# EAGLE design enclosure_controller_esp32 (EAGLE 9.6.2)
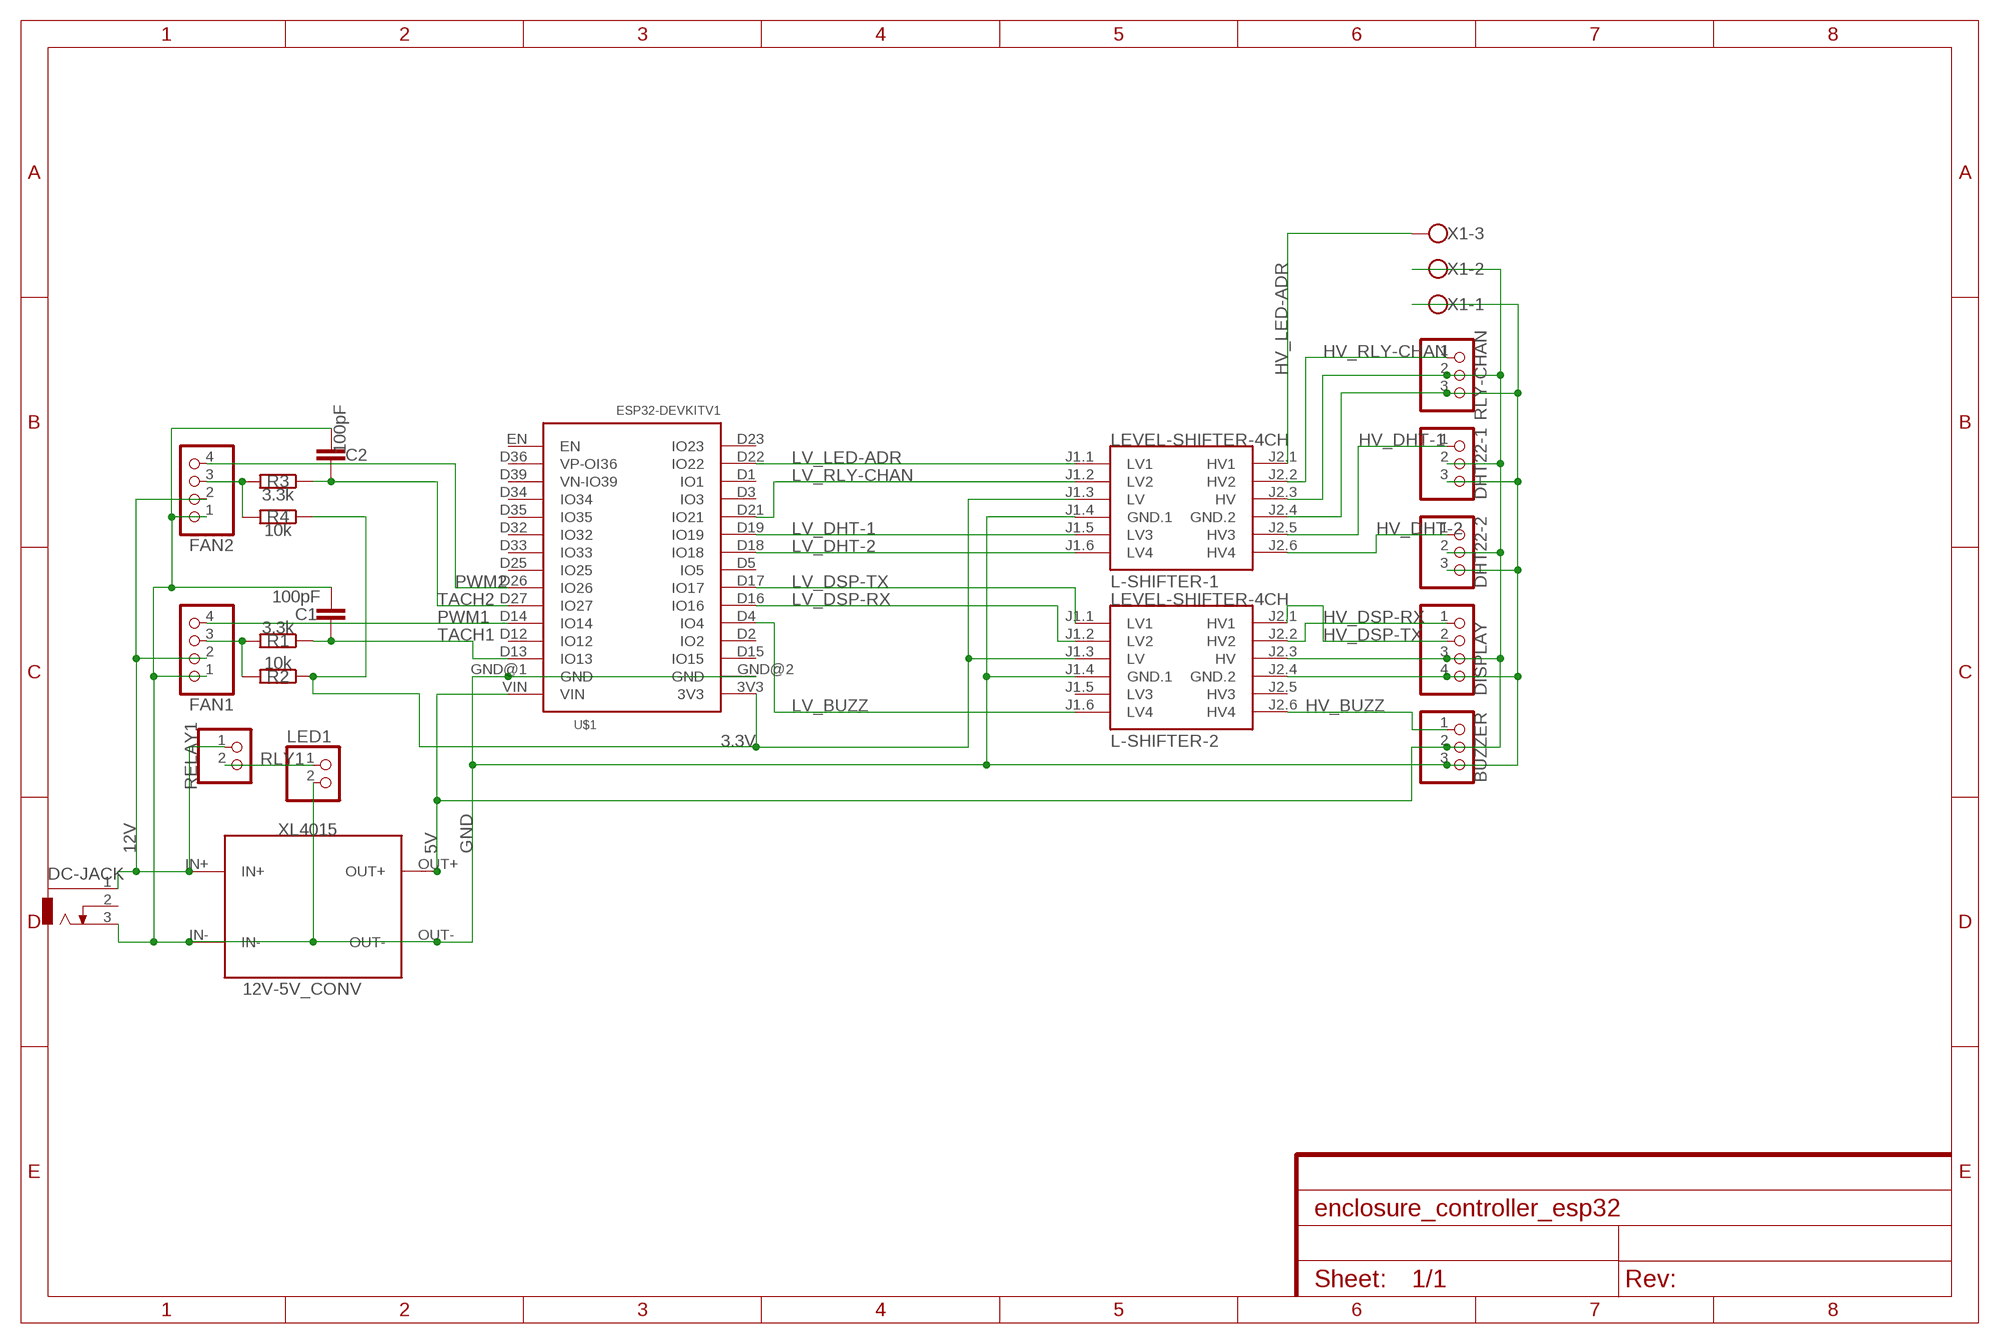
[diagram p0: schematic, sheet 1]

## Parts
12V-5V_CONV  XL4015  [XL4015]
BUZZER  PINHD-1X3  [1X03]
C1  100pF  C-EU050-025X075  [C050-025X075]
C2  100pF  C-EU050-025X075  [C050-025X075]
DC-JACK  DCJ0303  [DCJ0303]
DHT22-1  PINHD-1X3  [1X03]
DHT22-2  PINHD-1X3  [1X03]
DISPLAY  PINHD-1X4  [1X04]
FAN1  PINHD-1X4  [1X04]
FAN2  PINHD-1X4  [1X04]
L-SHIFTER-1  LEVEL-SHIFTER-4CH  [LEVEL-SHIFTER-4CH]
L-SHIFTER-2  LEVEL-SHIFTER-4CH  [LEVEL-SHIFTER-4CH]
LED1  PINHD-1X2  [1X02]
R1  3.3k  R-EU_0207/10  [0207/10]
R2  10k  R-EU_0207/10  [0207/10]
R3  3.3k  R-EU_0207/10  [0207/10]
R4  10k  R-EU_0207/10  [0207/10]
RELAY1  PINHD-1X2  [1X02]
RLY-CHAN  PINHD-1X3  [1X03]
U$1  ESP32DEVKITV1  [ESP32-DEVKITV1]
X1  LED2-ADR  W237-103  [W237-103]

## Nets
3.3V: L-SHIFTER-1.J1.3(LV) L-SHIFTER-2.J1.3(LV) R2.1 R4.1 U$1.3V3
5V: 12V-5V_CONV.OUT+ BUZZER.2 DHT22-1.2 DHT22-2.2 DISPLAY.3 L-SHIFTER-1.J2.3(HV) L-SHIFTER-2.J2.3(HV) RLY-CHAN.2 U$1.VIN X1.2
12V [Power]: 12V-5V_CONV.IN+ DC-JACK.1 FAN1.2 FAN2.2 RELAY1.1
GND: 12V-5V_CONV.IN- 12V-5V_CONV.OUT- BUZZER.3 C1.2 C2.1 DC-JACK.3 DHT22-1.3 DHT22-2.3 DISPLAY.4 FAN1.1 FAN2.1 L-SHIFTER-1.J1.4(GND.1) L-SHIFTER-1.J2.4(GND.2) L-SHIFTER-2.J1.4(GND.1) L-SHIFTER-2.J2.4(GND.2) LED1.2 RLY-CHAN.3 U$1.GND@1(GND) U$1.GND@2(GND) X1.1
HV_BUZZ: BUZZER.1 L-SHIFTER-2.J2.6(HV4)
HV_DHT-1: DHT22-1.1 L-SHIFTER-1.J2.5(HV3)
HV_DHT-2: DHT22-2.1 L-SHIFTER-1.J2.6(HV4)
HV_DSP-RX: DISPLAY.1 L-SHIFTER-2.J2.2(HV2)
HV_DSP-TX: DISPLAY.2 L-SHIFTER-2.J2.1(HV1)
HV_LED-ADR: L-SHIFTER-1.J2.1(HV1) X1.3
HV_RLY-CHAN: L-SHIFTER-1.J2.2(HV2) RLY-CHAN.1
LV_BUZZ [signals]: L-SHIFTER-2.J1.6(LV4) U$1.D4(IO4)
LV_DHT-1 [signals]: L-SHIFTER-1.J1.5(LV3) U$1.D19(IO19)
LV_DHT-2 [signals]: L-SHIFTER-1.J1.6(LV4) U$1.D18(IO18)
LV_DSP-RX: L-SHIFTER-2.J1.2(LV2) U$1.D16(IO16)
LV_DSP-TX: L-SHIFTER-2.J1.1(LV1) U$1.D17(IO17)
LV_LED-ADR: L-SHIFTER-1.J1.1(LV1) U$1.D22(IO22)
LV_RLY-CHAN: L-SHIFTER-1.J1.2(LV2) U$1.D21(IO21)
PWM1 [signals]: FAN1.4 U$1.D14(IO14)
PWM2 [signals]: FAN2.4 U$1.D26(IO26)
RLY1: LED1.1 RELAY1.2
TACH1 [signals]: C1.1 FAN1.3 R1.1 R1.2 R2.2 U$1.D13(IO13)
TACH2 [signals]: C2.2 FAN2.3 R3.1 R3.2 R4.2 U$1.D27(IO27)
Unconnected: DC-JACK.2 L-SHIFTER-2.J1.5(LV3) L-SHIFTER-2.J2.5(HV3) U$1.D1(IO1) U$1.D2(IO2) U$1.D3(IO3) U$1.D5(IO5) U$1.D12(IO12) U$1.D15(IO15) U$1.D23(IO23) U$1.D25(IO25) U$1.D32(IO32) U$1.D33(IO33) U$1.D34(IO34) U$1.D35(IO35) U$1.D36(VP-OI36) U$1.D39(VN-IO39) U$1.EN

## Library data of the parts
12V-5V_CONV = XL4015:XL4015
BUZZER DHT22-1 DHT22-2 RLY-CHAN = pinhead:PINHD-1X3: PIN HEADER
C1 C2 = rcl:C-EU: CAPACITOR, European symbol; SPICEPREFIX: C
DC-JACK = con-jack:DCJ0303: DC POWER JACK Source: DCJ0303.pdf; OC_FARNELL: unknown; OC_NEWARK: unknown
DISPLAY FAN1 FAN2 = pinhead:PINHD-1X4: PIN HEADER
L-SHIFTER-1 L-SHIFTER-2 = diy-modules:LEVEL-SHIFTER-4CH: 4-Channel Bi-Directional Logic Level Converter based on BSS128 transistors Click here to find device on ebay.com <http://www.ebay.com/sch/i2c+logic+converter+module>
LED1 RELAY1 = pinhead:PINHD-1X2: PIN HEADER
R1-R4 = rcl:R-EU_: RESISTOR, European symbol; SPICEPREFIX: R
U$1 = ESP32-DEVKITV1:ESP32DEVKITV1
X1 = con-wago-500:W237-103: WAGO SCREW CLAMP; MPN: 237-103; OC_FARNELL: unknown; OC_NEWARK: 18M7116

## Net classes
0 default: width 1 mm, drill 0.025 mm, clearance 0.4 mm
1 Power: width 1.5 mm, drill 0.025 mm, clearance 0.4 mm
2 signals: width 1 mm, drill 1 mm, clearance 0.4 mm

## Board
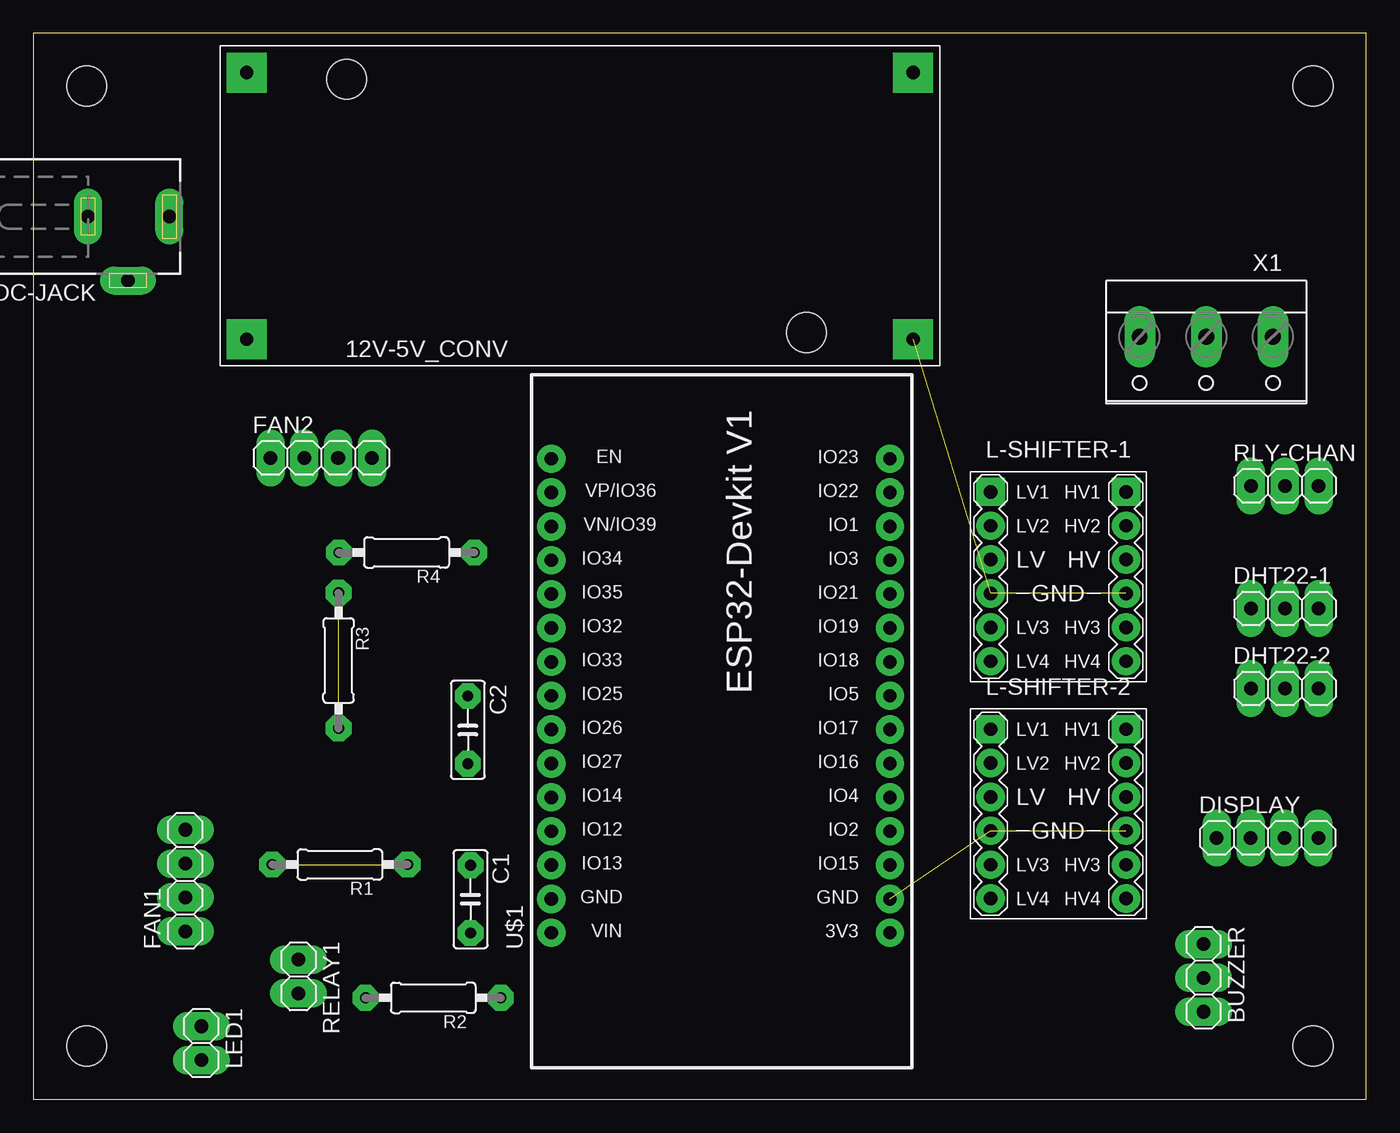
[diagram p1: board, top side]
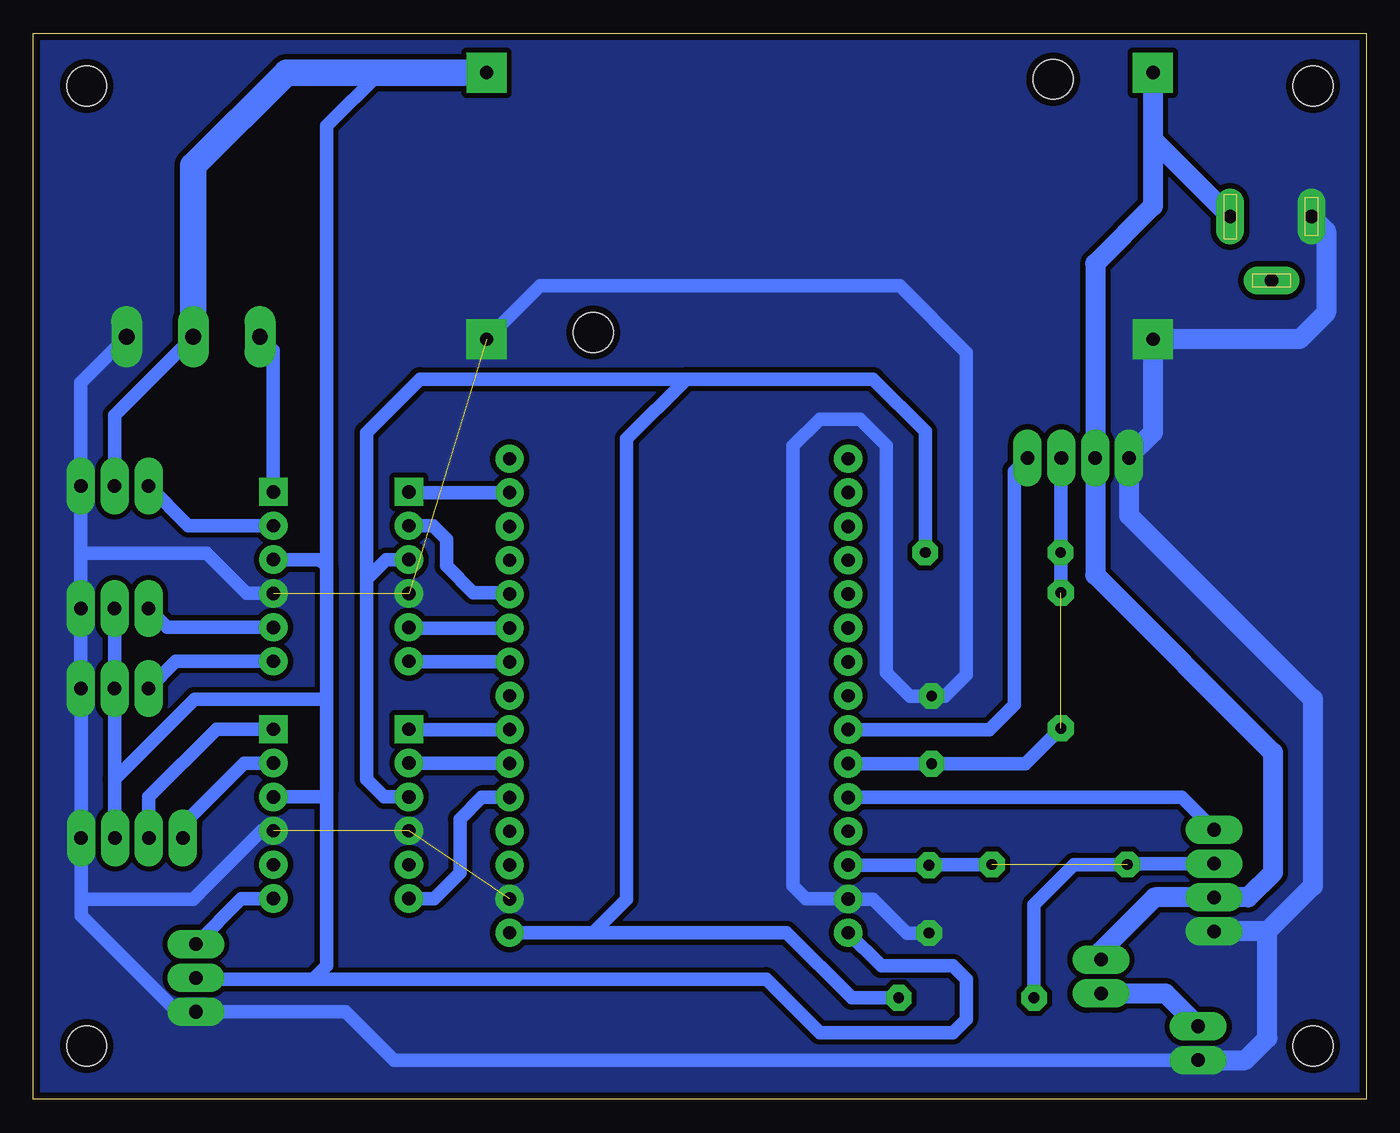
[diagram p2: board, bottom side, seen from below]

Size 100 x 79.94 mm. Coordinates in mm from the lower left corner, seen from the top.
Outline: 0,0 100,0 100,79.94 0,79.94 0,0
Copper layers (1*16): Top 0.035mm / dielectric 1.5mm / Bottom 0.035mm
Design rules "default *": minimum track width 6mil, minimum drill 0.35mm, track to track 0.4mm, track to pad 6mil, pad to pad 6mil, via to via 6mil, smd to smd 6mil, copper to edge 0.5mm, drill to drill 6mil, minimum pad ring 22mil, minimum via ring 8mil, stop-mask expansion 4mil, vias tented up to drill 0mil, thermal gap 10mil
Holes 3 mm at 4,76 96,76 96,4 4,4

### Footprints (pad centres in the part's own frame; a part is rotated, then mirrored left to right if it is on the bottom)
XL4015 = drill 1 pad 3 square: IN+ 2,22; IN- 2,2; OUT+ 52,22; OUT- 52,2 | hole 3: 9.5,21.5; 44,2.5
1X03 = drill 1.016 long: 1 -2.54,0; 2 0,0; 3 2.54,0
C050-025X075 = drill 0.813 octagon: 1 -2.54,0; 2 2.54,0
DCJ0303 = drill 1 pad 2 long: 1 0,3.1; 2 4.8,0; 3 0,-3
1X04 = drill 1.016 long: 1 -3.81,0; 2 -1.27,0; 3 1.27,0; 4 3.81,0
LEVEL-SHIFTER-4CH = drill 1 square: J1.1 -5.08,6.35; J2.1 5.08,6.35 | drill 1: J1.2 -5.08,3.81; J1.3 -5.08,1.27; J1.4 -5.08,-1.27; J1.5 -5.08,-3.81; J1.6 -5.08,-6.35; J2.2 5.08,3.81; J2.3 5.08,1.27; J2.4 5.08,-1.27; J2.5 5.08,-3.81; J2.6 5.08,-6.35
1X02 = drill 1.016 long: 1 -1.27,0; 2 1.27,0
0207/10 = drill 0.813 octagon: 1 -5.08,0; 2 5.08,0
ESP32-DEVKITV1 = drill 1 pad 1.93: 3V3 -16.52,-12.27; D1 13.96,-12.27; D2 -8.9,-12.27; D3 11.42,-12.27; D4 -6.36,-12.27; D5 1.26,-12.27; D12 -8.9,13.135; D13 -11.44,13.135; D14 -6.36,13.135; D15 -11.44,-12.27; D16 -3.82,-12.27; D17 -1.28,-12.27; D18 3.8,-12.27; D19 6.34,-12.27; D21 8.88,-12.27; D22 16.5,-12.27; D23 19.04,-12.27; D25 1.26,13.135; D26 -1.28,13.135; D27 -3.82,13.135; D32 6.34,13.135; D33 3.8,13.135; D34 11.42,13.135; D35 8.88,13.135; D36 16.5,13.135; D39 13.96,13.135; EN 19.04,13.135; GND@1 -13.98,13.135; GND@2 -13.98,-12.27; VIN -16.52,13.135
W237-103 = drill 1.194 long: 1 -5,-1.29; 2 0,-1.29; 3 5,-1.29

### Placement (x,y rotation side)
12V-5V_CONV  14,55 0 top
BUZZER  87.8,9.1 270 top
C1  32.8,15 270 top
C2  32.6,27.7 270 top
DC-JACK  7.1,66.2 270 top
DHT22-1  93.9,36.8 0 top
DHT22-2  93.9,30.8 0 top
DISPLAY  92.6,19.6 0 top
FAN1  11.4,16.4 90 top
FAN2  21.6,48.1 0 top
L-SHIFTER-1  76.9,39.2 0 top
L-SHIFTER-2  76.9,21.4 0 top
LED1  12.6,4.2 270 top
R1  23,17.6 180 top
R2  30,7.6 180 top
R3  22.9,32.9 270 top
R4  28,41 180 top
RELAY1  19.9,9.2 270 top
RLY-CHAN  93.9,46 0 top
U$1  52,29 90 top
X1  88,55.9 180 top

### Tracks (layer width: path | path; a pad name or v marks a point on that pad's centre or on a via)
3.3V
  Bottom 1: L-SHIFTER-2.J1.3 73.67,22.67 75,24 75,39 | 75,39 75,50 71,54 51,54 | L-SHIFTER-1.J1.3 73.53,40.47 75,39 | R4.1 33.08,50.08 37,54 51,54 | 51,54 55.48,49.52 55.48,15 58,12.48 | R2.1 38.6,7.6 43.48,12.48 58,12.48 | U$1.3V3 58,12.48
5V
  Bottom 1: DHT22-1.2 DHT22-2.2 93.9,24 | 93.9,24 93.9,19.63 DISPLAY.3 | X1.2 93.9,51.29 RLY-CHAN.2 | 74,77 78,73 78,40 | 78,40 78,30 | 78,30 78,23 | L-SHIFTER-2.J2.3 78.33,22.67 78,23 | L-SHIFTER-1.J2.3 78.47,40.47 78,40 | U$1.VIN 36.38,10 31,10 30,9 30,6 31,5 41,5 45,9 79,9 | 93.9,24 87.9,30 78,30 | BUZZER.2 87.7,9 79,9 | 79,9 78,10 78,23
  Bottom 2: X1.2 88,70 81,77 74,77 12V-5V_CONV.OUT+
12V
  Bottom 1.5: 12V-5V_CONV.IN+ 16,72 | 16,72 DC-JACK.1 | 16,72 16,67 20.33,62.67 FAN2.2 20.33,39.33 7,26 7,17 8.87,15.13 FAN1.2 15.87,15.13 19.9,11.1 RELAY1.1
GND  (4 unrouted)
  Bottom 1: C1.2 34.46,12.46 37,15 38.84,15 U$1.GND@1 42.02,15.02 43,16 43,49 41,51 38,51 36,49 36,32 34.24,30.24 C2.1 31.6,30.24 30,31.84 30,56 35,61 62,61 12V-5V_CONV.OUT- | 96.41,15 DISPLAY.4 96.41,30.77 DHT22-2.3 DHT22-1.3 96.44,40.93 | 96.41,15 96.41,13.77 89.2,6.56 BUZZER.3 76.56,6.56 72.93,2.93 LED1.2 | 96.44,40.93 RLY-CHAN.3 96.44,53.75 X1.1 | L-SHIFTER-1.J2.4 83.98,37.93 86.98,40.93 96.44,40.93 | L-SHIFTER-2.J2.4 82.87,20.13 88,15 96.41,15
  Bottom 1.5: 7.41,12.59 4,16 4,30 17.79,43.79 FAN2.1 17.79,48.21 16,50 12V-5V_CONV.IN- 5,57 3,59 3,65.1 DC-JACK.3 | 7.41,12.59 FAN1.1 | LED1.2 9.07,2.93 7.41,4.59 7.41,12.59
  pour Bottom (no thermals): 0,80 0,0 100,0 100,80
HV_BUZZ
  Bottom 1: BUZZER.1 84.39,15.05 L-SHIFTER-2.J2.6
HV_DHT-1
  Bottom 1: L-SHIFTER-1.J2.5 89.95,35.39 DHT22-1.1
HV_DHT-2
  Bottom 1: L-SHIFTER-1.J2.6 89.31,32.85 DHT22-2.1
HV_DSP-RX
  Bottom 1: L-SHIFTER-2.J2.2 84.18,25.21 88.79,20.6 DISPLAY.1
HV_DSP-TX
  Bottom 1: L-SHIFTER-2.J2.1 86.25,27.75 91.33,22.67 DISPLAY.2
HV_LED-ADR
  Bottom 1: X1.3 82,56.19 82,45.57 L-SHIFTER-1.J2.1
HV_RLY-CHAN
  Bottom 1: L-SHIFTER-1.J2.2 88.37,43.01 RLY-CHAN.1
LV_BUZZ
  Bottom 1: U$1.D4 66.36,22.64 68,21 68,17 69.95,15.05 L-SHIFTER-2.J1.6
LV_DHT-1
  Bottom 1: U$1.D19 71.77,35.34 L-SHIFTER-1.J1.5
LV_DHT-2
  Bottom 1: U$1.D18 71.77,32.8 L-SHIFTER-1.J1.6
LV_DSP-RX
  Bottom 1: L-SHIFTER-2.J1.2 64.3,25.21 U$1.D16
LV_DSP-TX
  Bottom 1: U$1.D17 71.79,27.72 L-SHIFTER-2.J1.1
LV_LED-ADR
  Bottom 1: L-SHIFTER-1.J1.1 71.77,45.5 U$1.D22
LV_RLY-CHAN
  Bottom 1: U$1.D21 64.39,38 67,38 69,40 69,42 70,43 L-SHIFTER-1.J1.2
PWM1
  Bottom 1: FAN1.4 13.83,22.64 U$1.D14
PWM2
  Bottom 1: FAN2.4 26.41,47.1 26.41,29.59 28.28,27.72 U$1.D26
RLY1
  Bottom 1.5: RELAY1.2 15.06,7.93 LED1.1
TACH1  (1 unrouted)
  Bottom 1: FAN1.3 17.85,17.67 R1.2 21.92,17.6 24.92,14.6 R2.2 | R1.1 32.74,17.6 C1.1 38.84,17.54 U$1.D13
TACH2  (1 unrouted)
  Bottom 1: R3.2 25.56,25.16 C2.2 38.84,25.16 U$1.D27 | FAN2.3 22.92,48.05 R4.2 22.92,38 R3.1